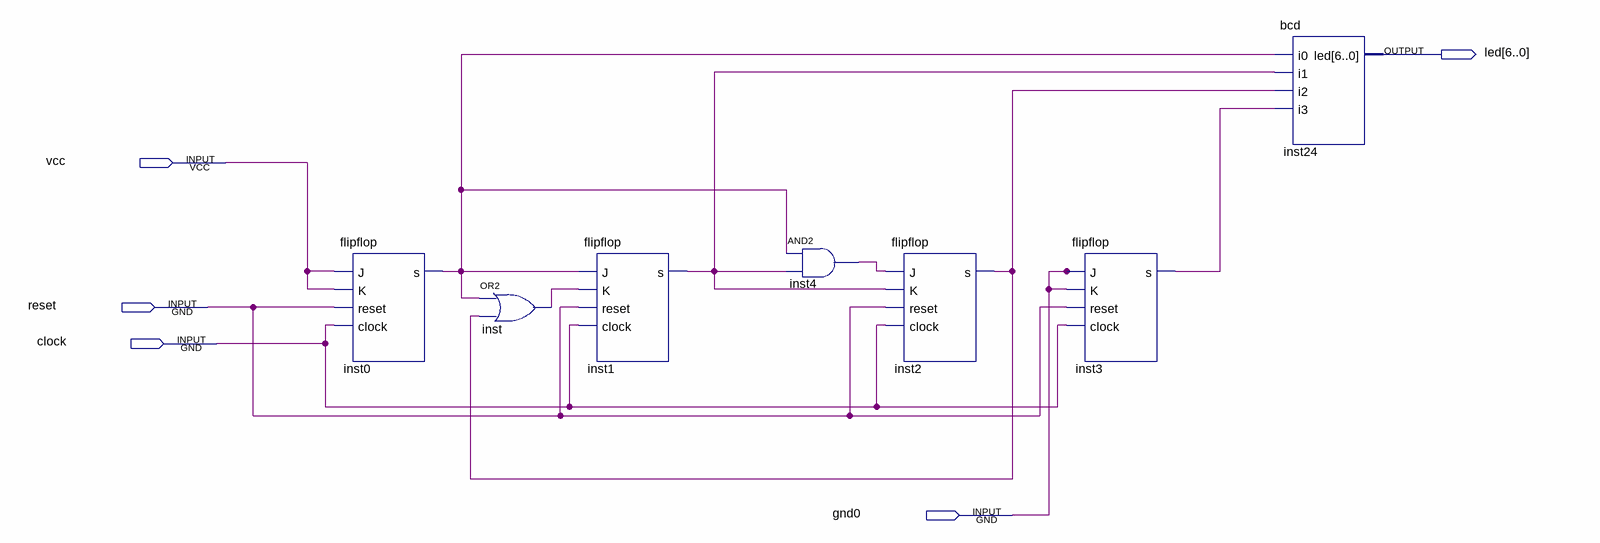
[diagram p0: schematic sheet]
// Quartus schematic blococontador.bdf as structural Verilog: 7 symbols, 5 pins
module blococontador (
  input  vcc,
  input  reset,
  input  clock,
  input  gnd0,
  output [6:0] led
);

  wire inst0_s, inst1_s, inst2_s, inst3_s, inst4_out, inst_out;

  flipflop inst0 (.J(vcc), .K(vcc), .reset(reset), .clock(clock), .s(inst0_s));
  or inst (inst_out, inst0_s, inst2_s);
  flipflop inst1 (.J(inst0_s), .K(inst_out), .reset(reset), .clock(clock), .s(inst1_s));
  and inst4 (inst4_out, inst0_s, inst1_s);
  flipflop inst2 (.J(inst4_out), .K(inst1_s), .reset(reset), .clock(clock), .s(inst2_s));
  flipflop inst3 (.J(gnd0), .K(gnd0), .reset(reset), .clock(clock), .s(inst3_s));
  bcd inst24 (.i0(inst0_s), .i1(inst1_s), .i2(inst2_s), .i3(inst3_s), .led(led));
endmodule
